# Altium schematic sheet 0.96OLED_4P_2024-05-03.schdoc
size 72 x 50 mm
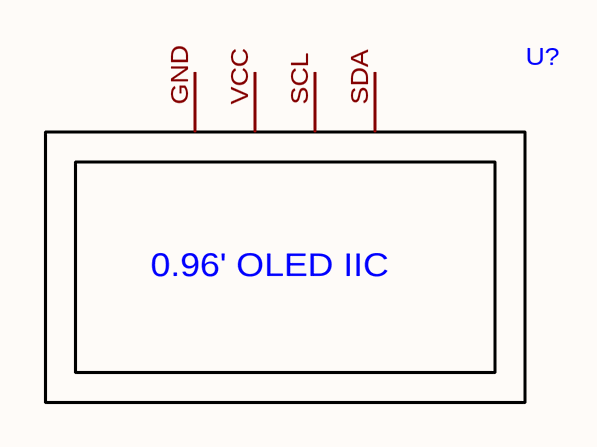
[diagram p0: 0.96OLED_4P_2024-05-03.schdoc]

## Parts
U?  (no value)  [0.96OLEDIIC]

## Nets

Not connected (* = marked no-connect by the designer): U? GND SCL SDA VCC

## Notes on the sheet
- (in symbol 0.96OLED_4P) 0.96' OLED IIC

## Library data of the parts
U? = 0.96OLED_4P